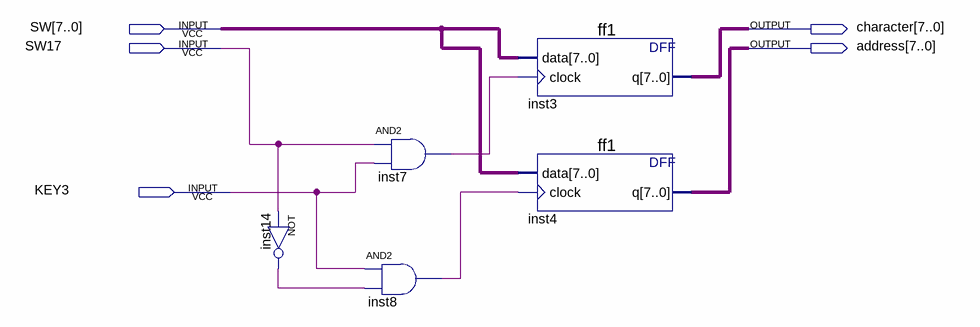
[diagram p0: schematic sheet]
// Quartus schematic ModuleTest.bdf as structural Verilog: 5 symbols, 5 pins
module ModuleTest (
  input  [7:0] SW,
  input  SW17,
  input  KEY3,
  output [7:0] character,
  output [7:0] address
);

  wire inst7_out, inst8_out, inst14_out;

  not inst14 (inst14_out, SW17);
  and inst7 (inst7_out, SW17, KEY3);
  and inst8 (inst8_out, KEY3, inst14_out);
  ff1 inst3 (.data(SW), .clock(inst7_out), .q(character));
  ff1 inst4 (.data(SW), .clock(inst8_out), .q(address));
endmodule
